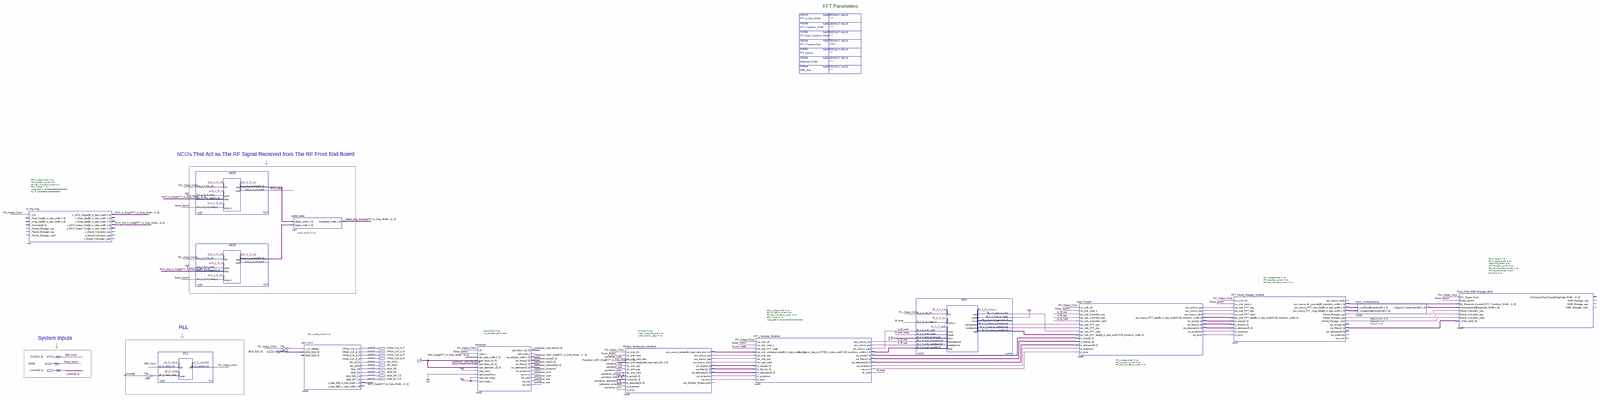
[diagram p0: schematic sheet, whole]
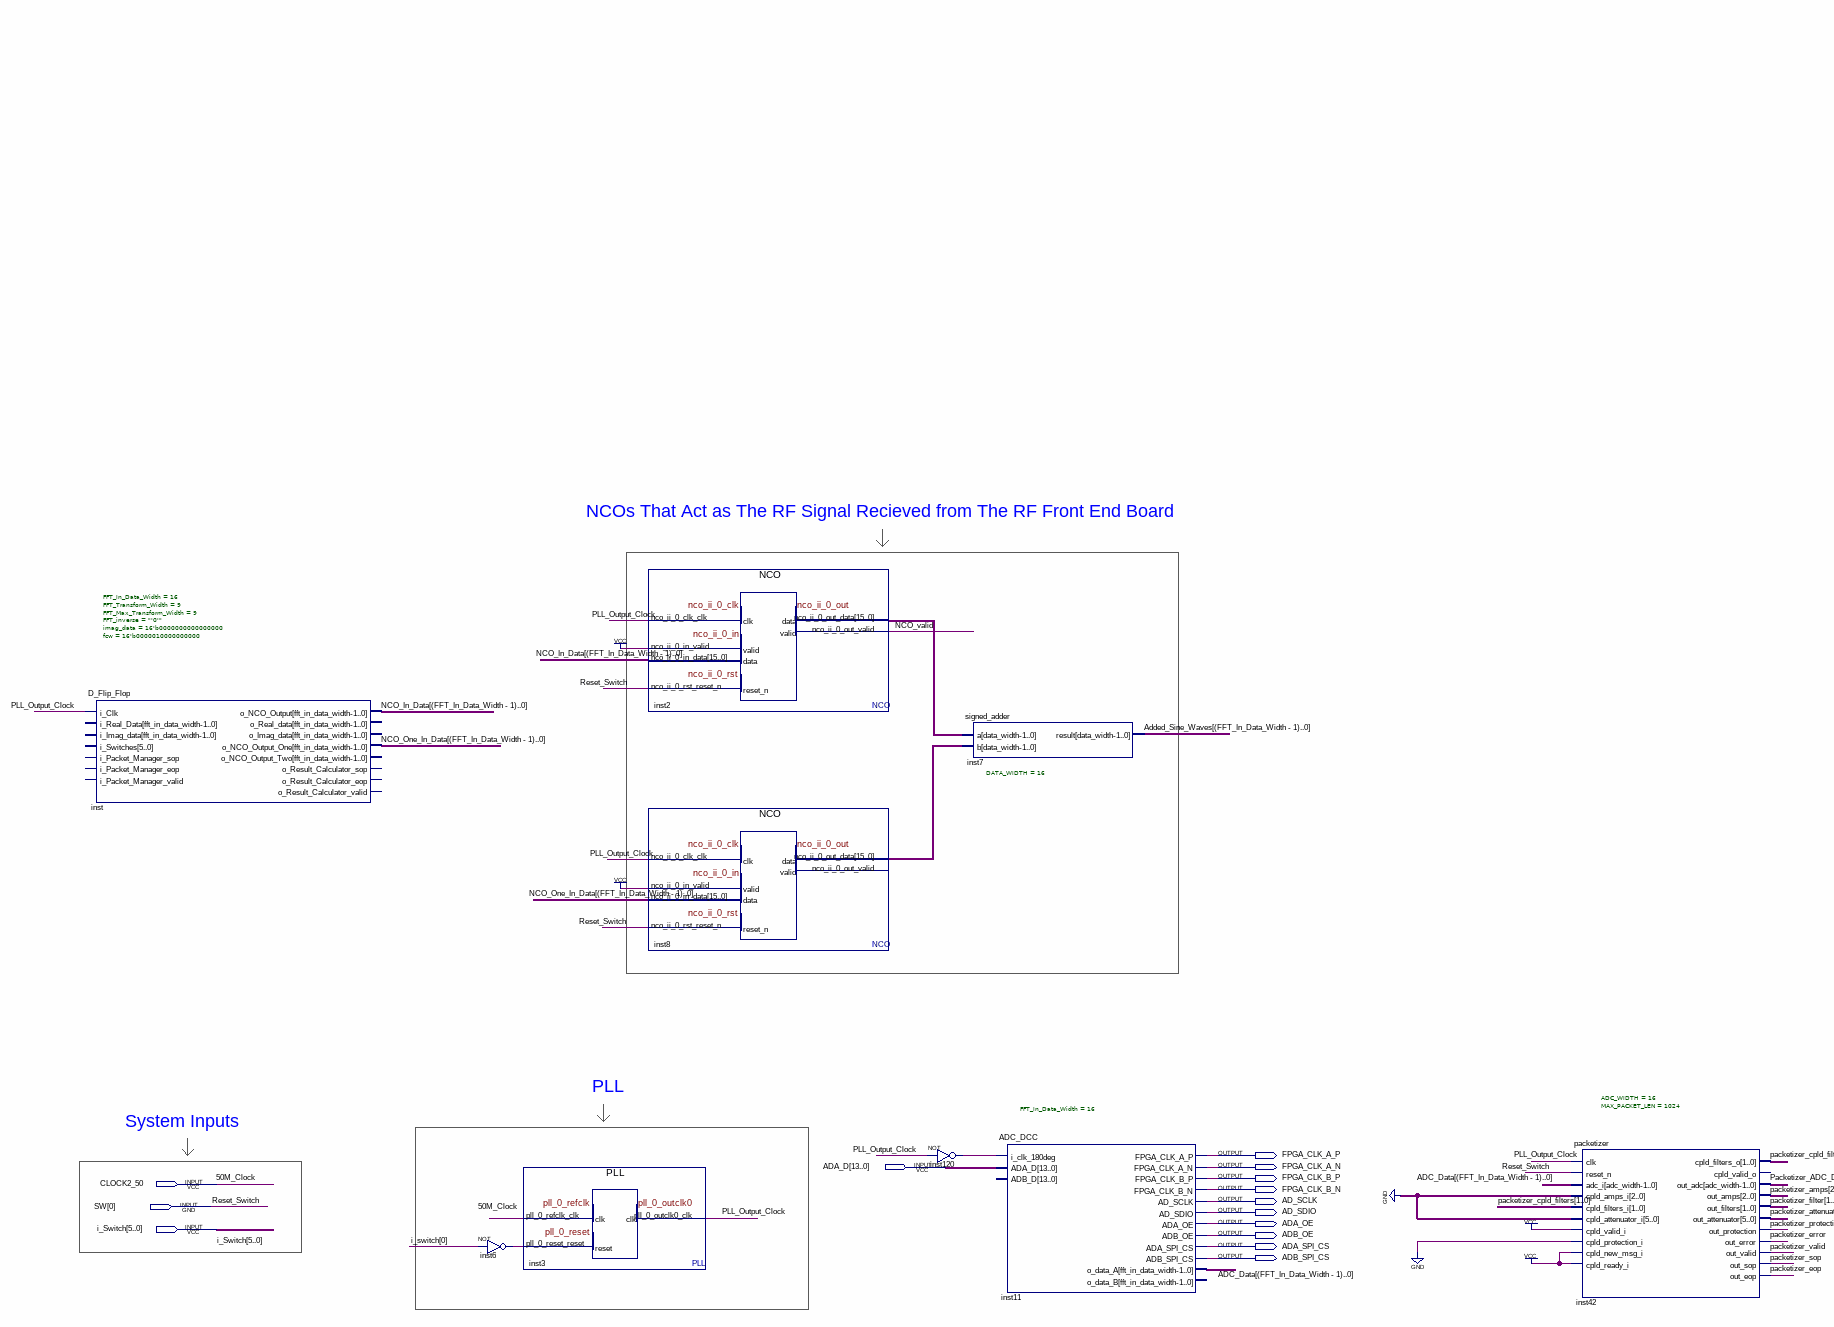
[diagram p1: schematic sheet, left part]
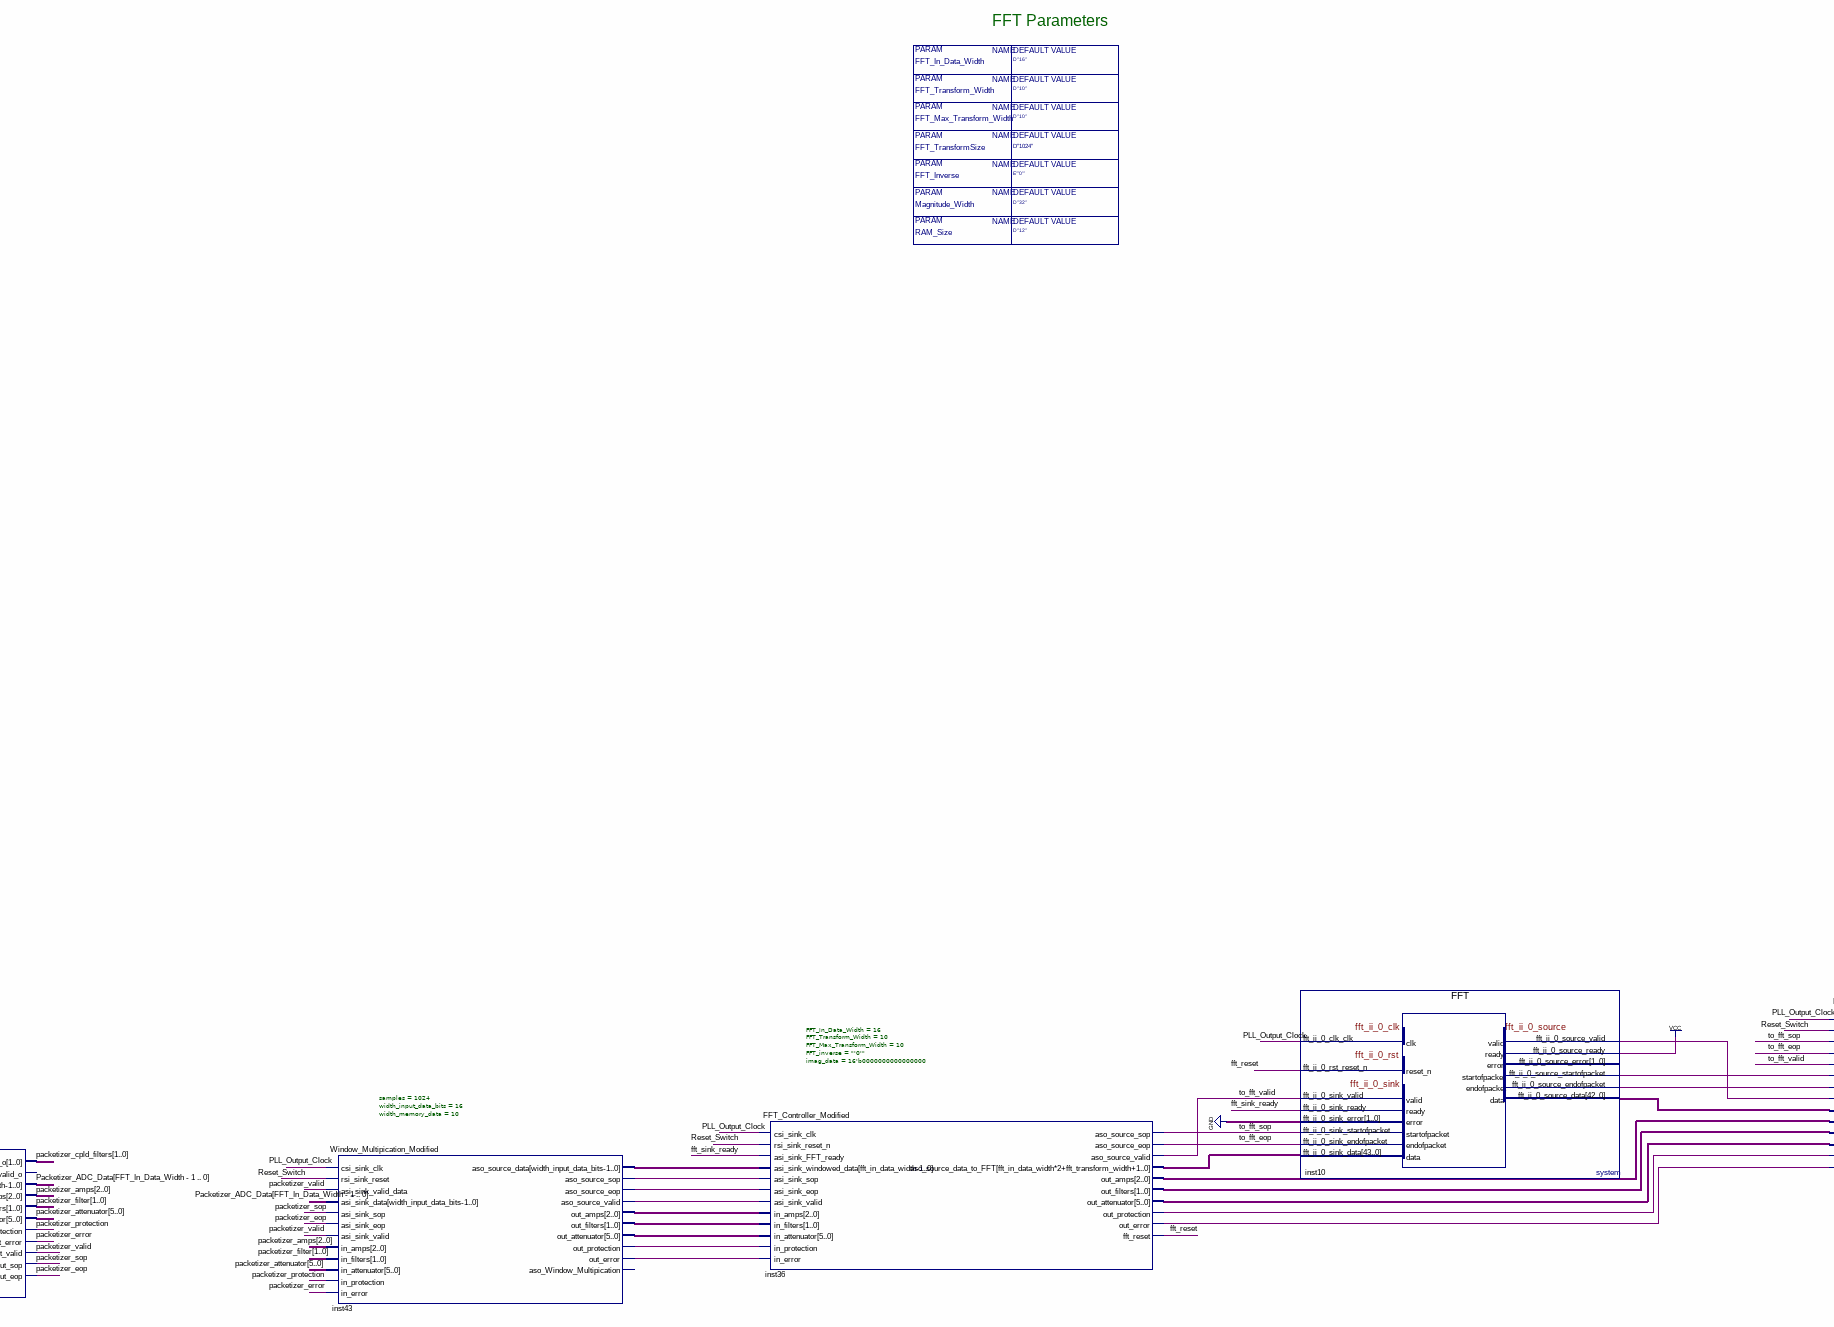
[diagram p2: schematic sheet, centre part]
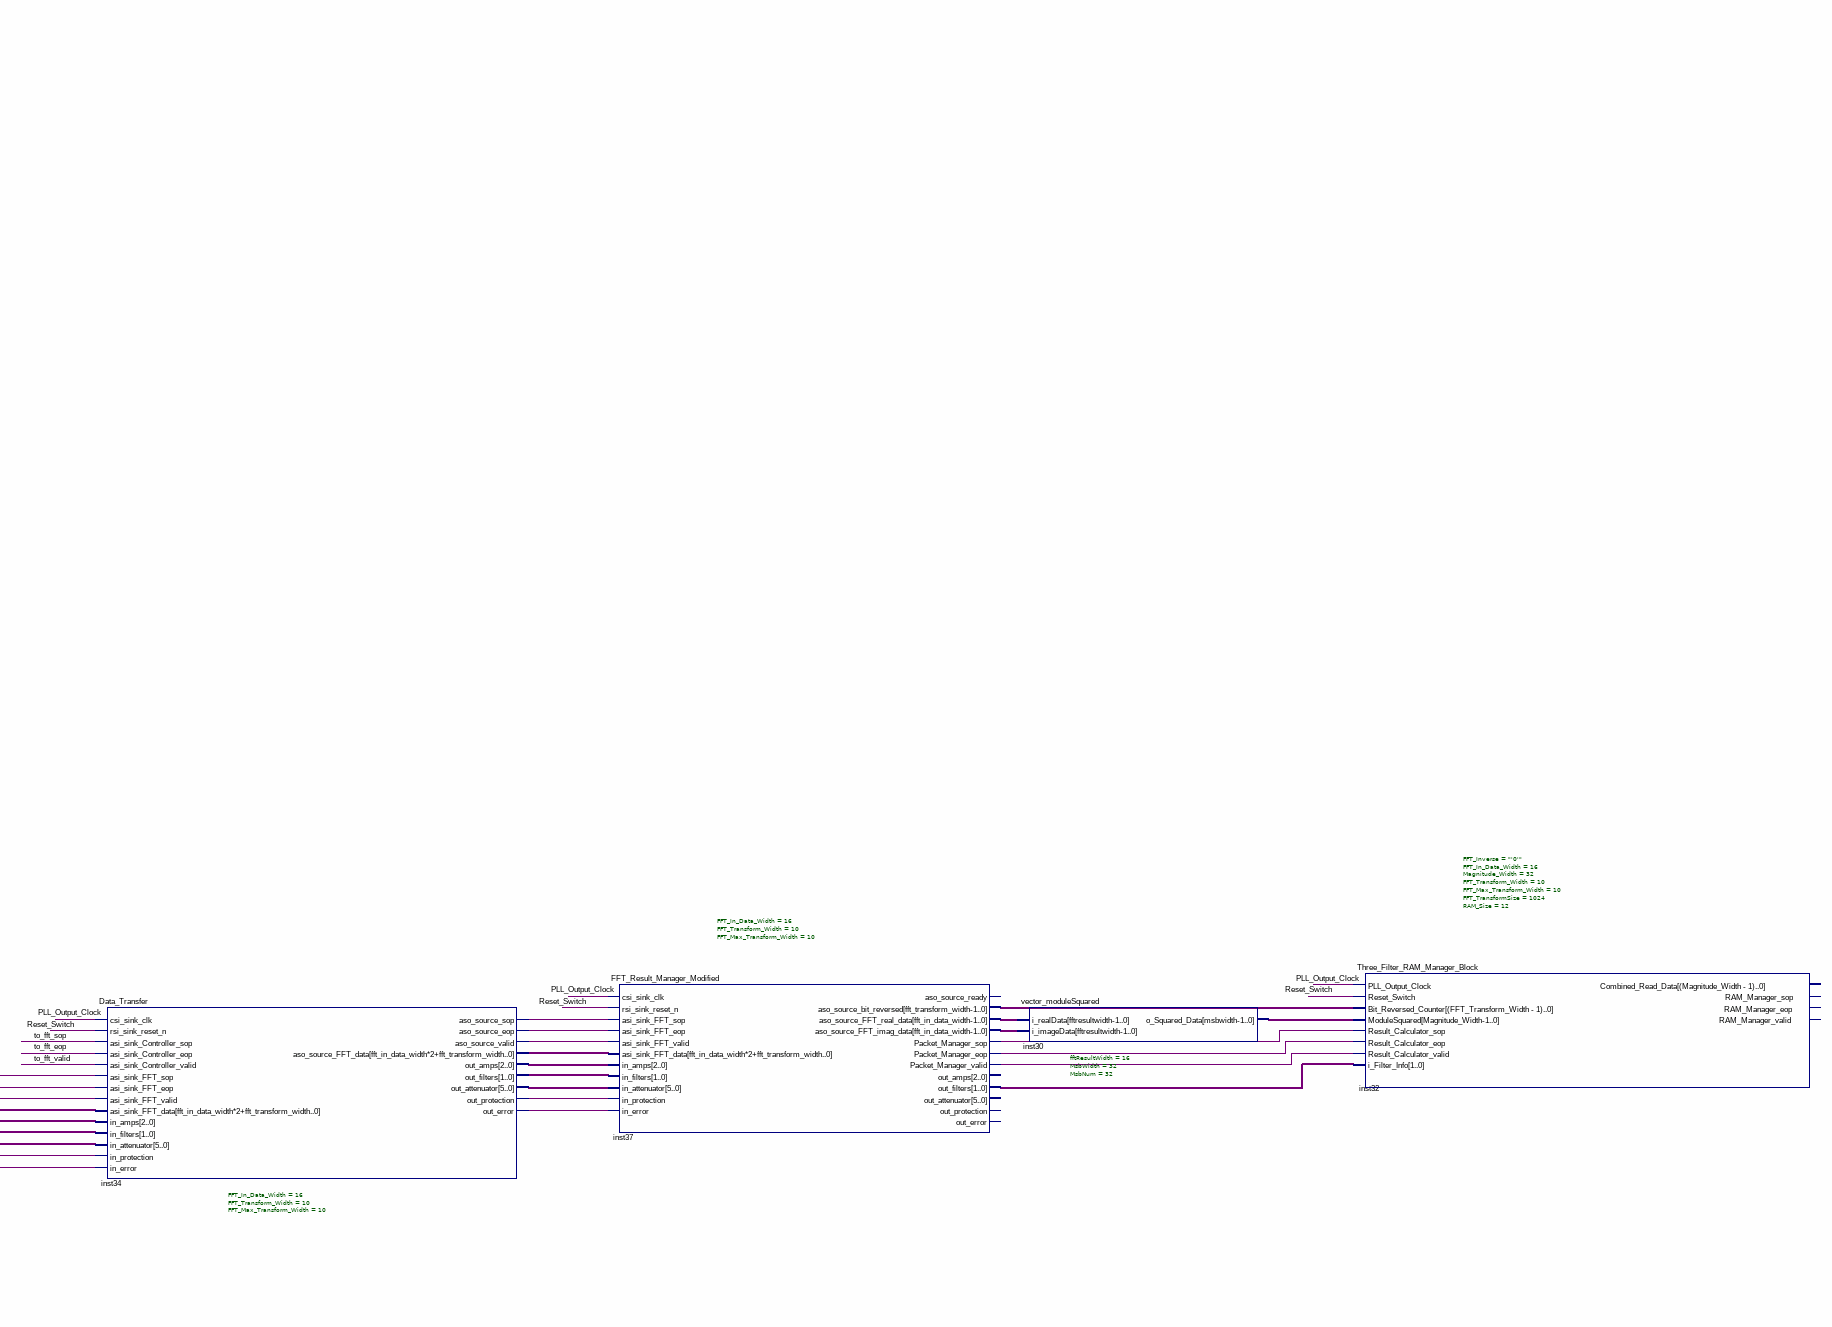
[diagram p3: schematic sheet, right part]
// Quartus schematic Windowed_Block_Diagram_Modified.bdf as structural Verilog: 16 symbols, 14 pins
module Windowed_Block_Diagram_Modified #(parameter FFT_Inverse = "E\"'0'\"", parameter FFT_In_Data_Width = "D\"16\"", parameter Magnitude_Width = "D\"32\"", parameter RAM_Size = "D\"12\"", parameter FFT_TransformSize = "D\"1024\"", parameter FFT_Max_Transform_Width = "D\"10\"", parameter FFT_Transform_Width = "D\"10\"") (
  input  [13:0] ADA_D,
  input  CLOCK2_50,
  input  [0:0] SW,
  input  [5:0] i_Switch,
  output FPGA_CLK_A_P,
  output FPGA_CLK_A_N,
  output FPGA_CLK_B_P,
  output FPGA_CLK_B_N,
  output AD_SCLK,
  output AD_SDIO,
  output ADA_OE,
  output ADB_OE,
  output ADA_SPI_CS,
  output ADB_SPI_CS
);

  wire \ADC_Data[(FFT_In_Data_Width_-_1)..0] , \Added_Sine_Waves[(FFT_In_Data_Width_-_1)..0] , fft_reset,
       fft_sink_ready, inst6_out, inst10_fft_ii_0_source_endofpacket, inst10_fft_ii_0_source_startofpacket,
       inst10_fft_ii_0_source_valid, inst34_aso_source_eop, inst34_aso_source_sop, inst34_aso_source_valid,
       inst34_out_error, inst34_out_protection, inst36_out_error, inst36_out_protection,
       inst37_packet_manager_eop, inst37_packet_manager_sop, inst37_packet_manager_valid,
       inst43_aso_source_eop, inst43_aso_source_sop, inst43_aso_source_valid, inst43_out_error,
       inst43_out_protection, inst120_out, \NCO_In_Data[(FFT_In_Data_Width_-_1)..0] ,
       \NCO_One_In_Data[(FFT_In_Data_Width_-_1)..0] , NCO_valid,
       \Packetizer_ADC_Data[FFT_In_Data_Width_-_1_.._0] , packetizer_eop, packetizer_error,
       packetizer_protection, packetizer_sop, packetizer_valid, PLL_Output_Clock, to_fft_eop, to_fft_sop,
       to_fft_valid;
  wire [1:0] inst34_out_filters, inst36_out_filters, inst37_out_filters, inst43_out_filters,
       packetizer_cpld_filters, packetizer_filter;
  wire [2:0] inst34_out_amps, inst36_out_amps, inst43_out_amps, packetizer_amps;
  wire [5:0] inst34_out_attenuator, inst36_out_attenuator, inst43_out_attenuator, packetizer_attenuator;
  wire [9:0] inst37_aso_source_bit_reversed;
  wire [15:0] inst2_nco_ii_0_out_data, inst8_nco_ii_0_out_data, inst37_aso_source_fft_imag_data,
       inst37_aso_source_fft_real_data, inst43_aso_source_data;
  wire [31:0] inst30_o_squared_data;
  wire [42:0] inst10_fft_ii_0_source_data, inst34_aso_source_fft_data;
  wire [43:0] inst36_aso_source_data_to_fft;

  D_Flip_Flop #(.FFT_In_Data_Width(16), .FFT_Transform_Width(9), .FFT_Max_Transform_Width(9), .FFT_inverse("'0'"), .imag_data(16'b0000000000000000), .fcw(16'b0000010000000000)) inst (
    .i_Clk(PLL_Output_Clock), .o_NCO_Output(\NCO_In_Data[(FFT_In_Data_Width_-_1)..0] ),
    .o_NCO_Output_One(\NCO_One_In_Data[(FFT_In_Data_Width_-_1)..0] ));  // open: i_Real_Data, i_Imag_data, i_Switches, i_Packet_Manager_sop, i_Packet_Manager_eop, i_Packet_Manager_valid, o_Real_data, o_Imag_data, o_NCO_Output_Two, o_Result_Calculator_sop, o_Result_Calculator_eop, o_Result_Calculator_valid
  not inst6 (inst6_out, i_Switch[0]);
  PLL inst3 (.pll_0_refclk_clk(CLOCK2_50), .pll_0_reset_reset(inst6_out), .pll_0_outclk0_clk(PLL_Output_Clock));
  NCO inst2 (
    .nco_ii_0_clk_clk(PLL_Output_Clock), .nco_ii_0_in_valid(1'b1),
    .nco_ii_0_in_data({16{\NCO_In_Data[(FFT_In_Data_Width_-_1)..0] }}), .nco_ii_0_rst_reset_n(SW[0]),
    .nco_ii_0_out_data(inst2_nco_ii_0_out_data), .nco_ii_0_out_valid(NCO_valid));
  NCO inst8 (
    .nco_ii_0_clk_clk(PLL_Output_Clock), .nco_ii_0_in_valid(1'b1),
    .nco_ii_0_in_data({16{\NCO_One_In_Data[(FFT_In_Data_Width_-_1)..0] }}), .nco_ii_0_rst_reset_n(SW[0]),
    .nco_ii_0_out_data(inst8_nco_ii_0_out_data));  // open: nco_ii_0_out_valid
  signed_adder #(.DATA_WIDTH(16)) inst7 (
    .a(inst2_nco_ii_0_out_data), .b(inst8_nco_ii_0_out_data),
    .result(\Added_Sine_Waves[(FFT_In_Data_Width_-_1)..0] ));
  not inst120 (inst120_out, PLL_Output_Clock);
  ADC_DCC #(.FFT_In_Data_Width(16)) inst11 (
    .i_clk_180deg(inst120_out), .ADA_D(ADA_D), .FPGA_CLK_A_P(FPGA_CLK_A_P), .FPGA_CLK_A_N(FPGA_CLK_A_N),
    .FPGA_CLK_B_P(FPGA_CLK_B_P), .FPGA_CLK_B_N(FPGA_CLK_B_N), .AD_SCLK(AD_SCLK), .AD_SDIO(AD_SDIO),
    .ADA_OE(ADA_OE), .ADB_OE(ADB_OE), .ADA_SPI_CS(ADA_SPI_CS), .ADB_SPI_CS(ADB_SPI_CS),
    .o_data_A(\ADC_Data[(FFT_In_Data_Width_-_1)..0] ));  // open: ADB_D, o_data_B
  packetizer #(.ADC_WIDTH(16), .MAX_PACKET_LEN(1024)) inst42 (
    .clk(PLL_Output_Clock), .reset_n(SW[0]), .adc_i({16{\ADC_Data[(FFT_In_Data_Width_-_1)..0] }}),
    .cpld_amps_i({6{1'b0}}), .cpld_filters_i(packetizer_cpld_filters), .cpld_attenuator_i({6{1'b0}}),
    .cpld_valid_i(1'b1), .cpld_protection_i(1'b0), .cpld_new_msg_i(1'b1), .cpld_ready_i(1'b1),
    .cpld_filters_o(packetizer_cpld_filters), .out_adc(\Packetizer_ADC_Data[FFT_In_Data_Width_-_1_.._0] ),
    .out_amps(packetizer_amps), .out_filters(packetizer_filter), .out_attenuator(packetizer_attenuator),
    .out_protection(packetizer_protection), .out_error(packetizer_error), .out_valid(packetizer_valid),
    .out_sop(packetizer_sop), .out_eop(packetizer_eop));  // open: cpld_valid_o
  Window_Multipication_Modified #(.samples(1024), .width_input_data_bits(16), .width_memory_data(10)) inst43 (
    .csi_sink_clk(PLL_Output_Clock), .rsi_sink_reset(SW[0]), .asi_sink_valid_data(packetizer_valid),
    .asi_sink_data({16{\Packetizer_ADC_Data[FFT_In_Data_Width_-_1_.._0] }}), .asi_sink_sop(packetizer_sop),
    .asi_sink_eop(packetizer_eop), .asi_sink_valid(packetizer_valid), .in_amps(packetizer_amps),
    .in_filters(packetizer_filter), .in_attenuator(packetizer_attenuator),
    .in_protection(packetizer_protection), .in_error(packetizer_error),
    .aso_source_data(inst43_aso_source_data), .aso_source_sop(inst43_aso_source_sop),
    .aso_source_eop(inst43_aso_source_eop), .aso_source_valid(inst43_aso_source_valid),
    .out_amps(inst43_out_amps), .out_filters(inst43_out_filters), .out_attenuator(inst43_out_attenuator),
    .out_protection(inst43_out_protection), .out_error(inst43_out_error));  // open: aso_Window_Multipication
  FFT_Controller_Modified #(.FFT_In_Data_Width(16), .FFT_Transform_Width(10), .FFT_Max_Transform_Width(10), .FFT_inverse("'0'"), .imag_data(16'b0000000000000000)) inst36 (
    .csi_sink_clk(PLL_Output_Clock), .rsi_sink_reset_n(SW[0]), .asi_sink_FFT_ready(fft_sink_ready),
    .asi_sink_windowed_data(inst43_aso_source_data), .asi_sink_sop(inst43_aso_source_sop),
    .asi_sink_eop(inst43_aso_source_eop), .asi_sink_valid(inst43_aso_source_valid),
    .in_amps(inst43_out_amps), .in_filters(inst43_out_filters), .in_attenuator(inst43_out_attenuator),
    .in_protection(inst43_out_protection), .in_error(inst43_out_error), .aso_source_sop(to_fft_sop),
    .aso_source_eop(to_fft_eop), .aso_source_valid(to_fft_valid),
    .aso_source_data_to_FFT(inst36_aso_source_data_to_fft), .out_amps(inst36_out_amps),
    .out_filters(inst36_out_filters), .out_attenuator(inst36_out_attenuator),
    .out_protection(inst36_out_protection), .out_error(inst36_out_error), .fft_reset(fft_reset));
  FFT inst10 (
    .fft_ii_0_clk_clk(PLL_Output_Clock), .fft_ii_0_rst_reset_n(fft_reset),
    .fft_ii_0_sink_valid(to_fft_valid), .fft_ii_0_sink_error(2'b00),
    .fft_ii_0_sink_startofpacket(to_fft_sop), .fft_ii_0_sink_endofpacket(to_fft_eop),
    .fft_ii_0_sink_data(inst36_aso_source_data_to_fft), .fft_ii_0_source_ready(1'b1),
    .fft_ii_0_sink_ready(fft_sink_ready), .fft_ii_0_source_valid(inst10_fft_ii_0_source_valid),
    .fft_ii_0_source_startofpacket(inst10_fft_ii_0_source_startofpacket),
    .fft_ii_0_source_endofpacket(inst10_fft_ii_0_source_endofpacket),
    .fft_ii_0_source_data(inst10_fft_ii_0_source_data));  // open: fft_ii_0_source_error
  Data_Transfer #(.FFT_In_Data_Width(16), .FFT_Transform_Width(10), .FFT_Max_Transform_Width(10)) inst34 (
    .csi_sink_clk(PLL_Output_Clock), .rsi_sink_reset_n(SW[0]), .asi_sink_Controller_sop(to_fft_sop),
    .asi_sink_Controller_eop(to_fft_eop), .asi_sink_Controller_valid(to_fft_valid),
    .asi_sink_FFT_sop(inst10_fft_ii_0_source_startofpacket),
    .asi_sink_FFT_eop(inst10_fft_ii_0_source_endofpacket), .asi_sink_FFT_valid(inst10_fft_ii_0_source_valid),
    .asi_sink_FFT_data(inst10_fft_ii_0_source_data), .in_amps(inst36_out_amps),
    .in_filters(inst36_out_filters), .in_attenuator(inst36_out_attenuator),
    .in_protection(inst36_out_protection), .in_error(inst36_out_error),
    .aso_source_sop(inst34_aso_source_sop), .aso_source_eop(inst34_aso_source_eop),
    .aso_source_valid(inst34_aso_source_valid), .aso_source_FFT_data(inst34_aso_source_fft_data),
    .out_amps(inst34_out_amps), .out_filters(inst34_out_filters), .out_attenuator(inst34_out_attenuator),
    .out_protection(inst34_out_protection), .out_error(inst34_out_error));
  FFT_Result_Manager_Modified #(.FFT_In_Data_Width(16), .FFT_Transform_Width(10), .FFT_Max_Transform_Width(10)) inst37 (
    .csi_sink_clk(PLL_Output_Clock), .rsi_sink_reset_n(SW[0]), .asi_sink_FFT_sop(inst34_aso_source_sop),
    .asi_sink_FFT_eop(inst34_aso_source_eop), .asi_sink_FFT_valid(inst34_aso_source_valid),
    .asi_sink_FFT_data(inst34_aso_source_fft_data), .in_amps(inst34_out_amps),
    .in_filters(inst34_out_filters), .in_attenuator(inst34_out_attenuator),
    .in_protection(inst34_out_protection), .in_error(inst34_out_error),
    .aso_source_bit_reversed(inst37_aso_source_bit_reversed),
    .aso_source_FFT_real_data(inst37_aso_source_fft_real_data),
    .aso_source_FFT_imag_data(inst37_aso_source_fft_imag_data),
    .Packet_Manager_sop(inst37_packet_manager_sop), .Packet_Manager_eop(inst37_packet_manager_eop),
    .Packet_Manager_valid(inst37_packet_manager_valid), .out_filters(inst37_out_filters));  // open: aso_source_ready, out_amps, out_attenuator, out_protection, out_error
  vector_moduleSquared #(.fftResultWidth(16), .MsbWidth(32), .MsbNum(32)) inst30 (
    .i_realData(inst37_aso_source_fft_real_data), .i_imageData(inst37_aso_source_fft_imag_data),
    .o_Squared_Data(inst30_o_squared_data));
  Three_Filter_RAM_Manager_Block #(.FFT_Inverse("'0'"), .FFT_In_Data_Width(16), .Magnitude_Width(32), .FFT_Transform_Width(10), .FFT_Max_Transform_Width(10), .FFT_TransformSize(1024), .RAM_Size(12)) inst32 (
    .PLL_Output_Clock(PLL_Output_Clock), .Reset_Switch(SW[0]),
    .Bit_Reversed_Counter(inst37_aso_source_bit_reversed), .ModuleSquared(inst30_o_squared_data),
    .Result_Calculator_sop(inst37_packet_manager_sop), .Result_Calculator_eop(inst37_packet_manager_eop),
    .Result_Calculator_valid(inst37_packet_manager_valid), .i_Filter_Info(inst37_out_filters));  // open: Combined_Read_Data, RAM_Manager_sop, RAM_Manager_eop, RAM_Manager_valid

  // Other names for the same wires on the sheet: 50M_Clock = CLOCK2_50; Reset_Switch = SW[0]

  // Notes on the sheet:
  //   FFT Parameters
  //   NCOs That Act as The RF Signal Recieved from The RF Front End Board       
  //   PLL
  //   System Inputs   
endmodule
